# EAGLE design devboard (EAGLE 4.16)
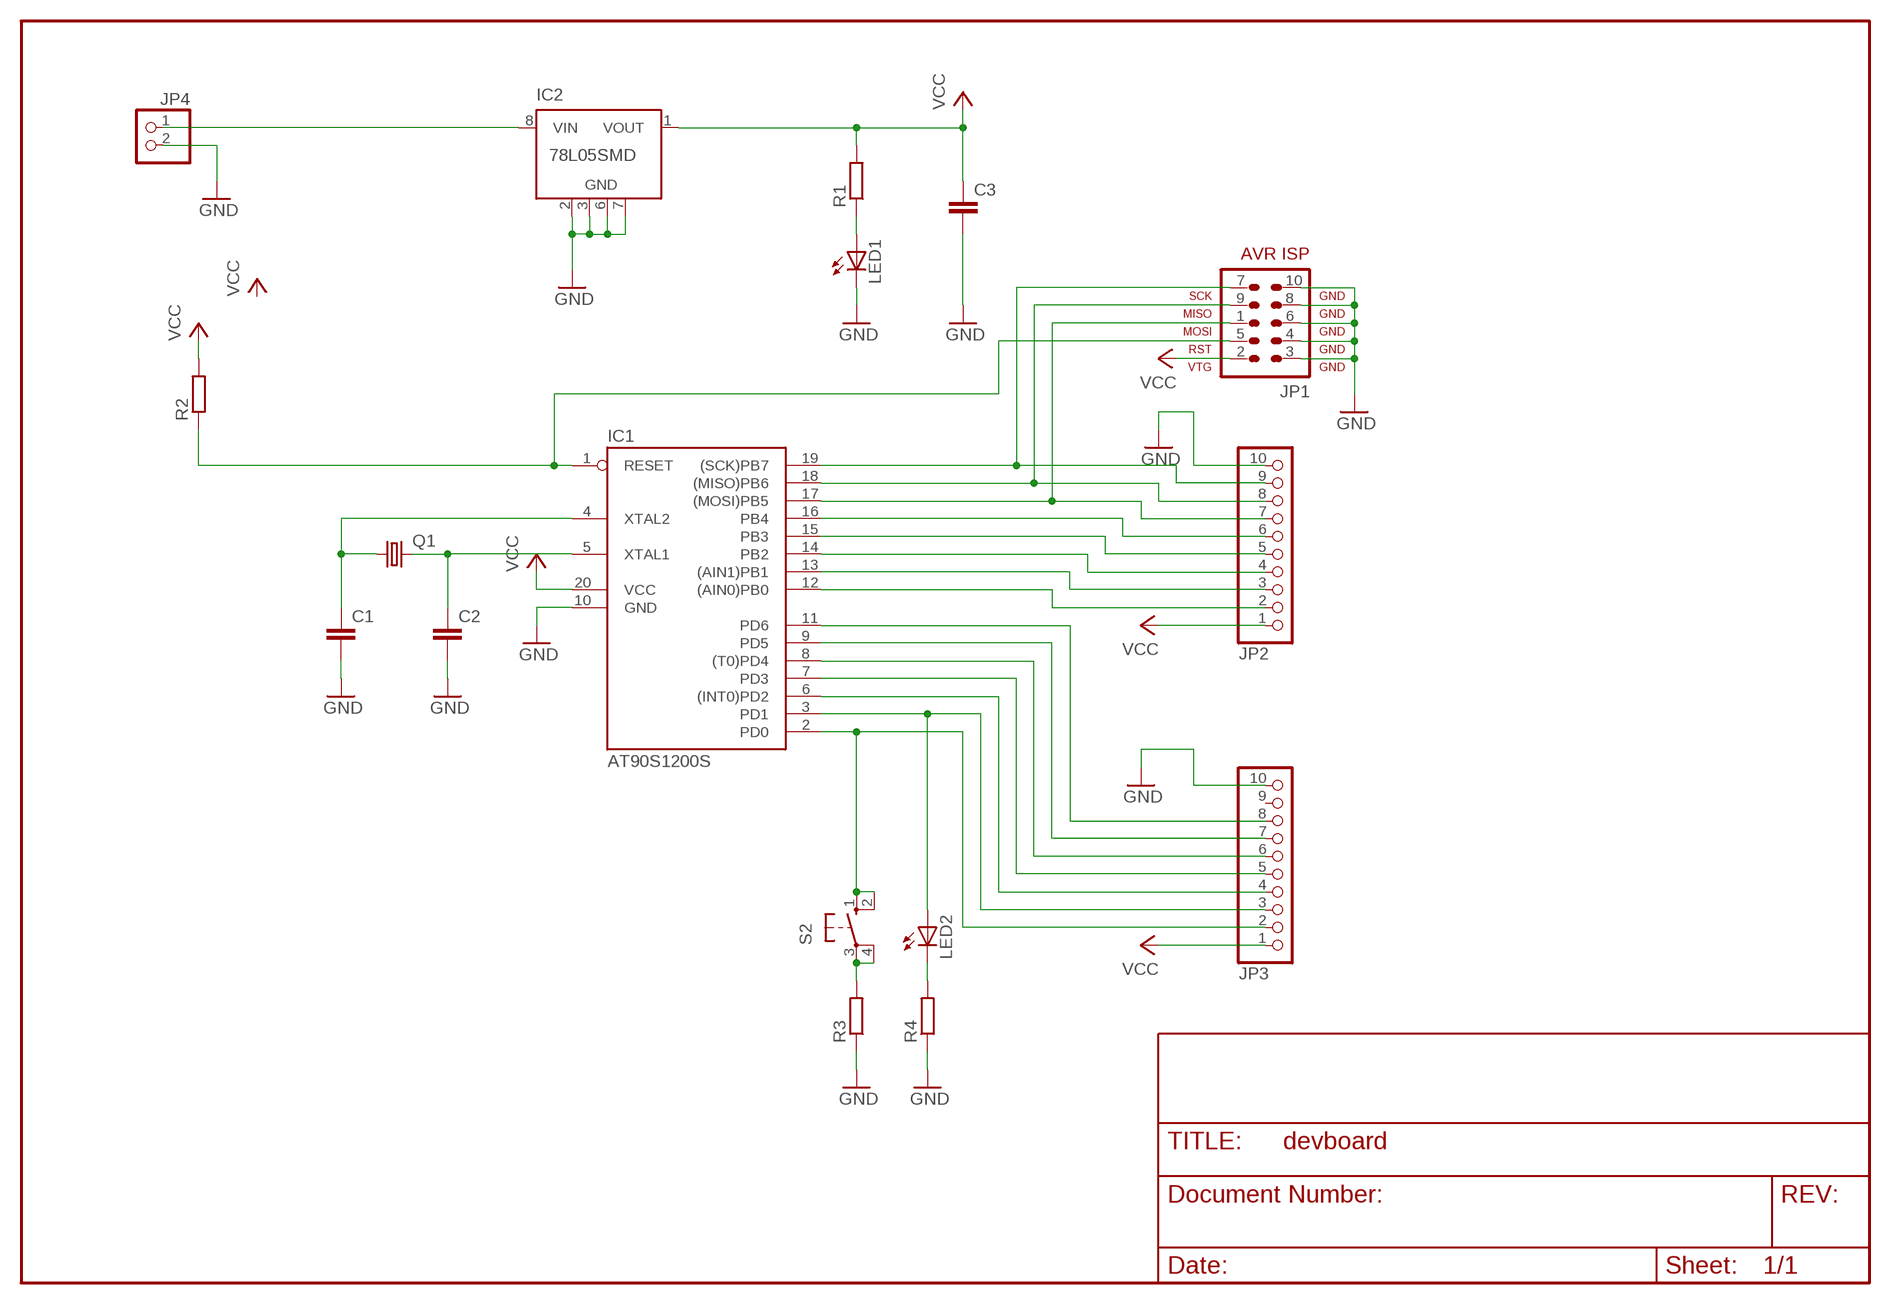
[diagram p0: schematic, sheet 1]

## Parts
C1  C-EUC1206  [C1206]
C2  C-EUC1206  [C1206]
C3  C-EUC1206  [C1206]
IC1  AT90S1200S  [SO20W]
IC2  78L05SMD  [SO08]
JP1  AVR-ISP-10  [AVR-ISP-10]
JP2  PINHD-1X10  [1X10]
JP3  PINHD-1X10  [1X10]
JP4  PINHD-1X2  [1X02]
LED1  LEDCHIPLED_1206  [CHIPLED_1206]
LED2  LEDCHIPLED_1206  [CHIPLED_1206]
Q1  CRYTALHC49UP  [HC49UP]
R1  R-EU_R1206  [R1206]
R2  R-EU_R1206  [R1206]
R3  R-EU_R1206  [R1206]
R4  R-EU_R1206  [R1206]
S2  10-XX  [B3F-10XX]

## Nets
GND: C1.2 C2.2 C3.2 IC1.10(GND) IC2.2(GND) IC2.3(GND) IC2.6(GND) IC2.7(GND) JP1.3 JP1.4 JP1.6 JP1.8 JP1.10 JP2.10 JP3.10 JP4.2 LED1.C R3.1 R4.1
N$1: C2.1 IC1.5(XTAL1) Q1.2
N$2: C1.1 IC1.4(XTAL2) Q1.1
N$3: LED1.A R1.1
N$4: IC2.8(VIN) JP4.1
N$5: IC1.1(RESET) JP1.5 R2.1
N$6: IC1.9(PD5) JP3.7
N$7: R3.2 S2.3(P) S2.4(P1)
N$8: IC1.2(PD0) JP3.2 S2.1(S) S2.2(S1)
N$9: LED2.C R4.2
N$10: IC1.3(PD1) JP3.3 LED2.A
N$11: IC1.19((SCK)PB7) JP1.7 JP2.9
N$12: IC1.18((MISO)PB6) JP1.9 JP2.8
N$13: IC1.17((MOSI)PB5) JP1.1 JP2.7
N$14: IC1.11(PD6) JP3.8
N$15: IC1.12((AIN0)PB0) JP2.2
N$16: IC1.13((AIN1)PB1) JP2.3
N$17: IC1.6((INT0)PD2) JP3.4
N$18: IC1.7(PD3) JP3.5
N$19: IC1.8((T0)PD4) JP3.6
N$20: IC1.14(PB2) JP2.4
N$21: IC1.15(PB3) JP2.5
N$22: IC1.16(PB4) JP2.6
VCC: C3.1 IC1.20(VCC) IC2.1(VOUT) JP1.2 JP2.1 JP3.1 R1.2 R2.2
Unconnected: IC2.4(NC) IC2.5(NC) JP3.9

## Library data of the parts
C1-C3 = rcl:C-EU: CAPACITOR, European symbol
IC1 = atmel:AT90S1200: MICROCONTROLLER 1 Kbytes FLASH 64 bytes EEPROM
IC2 = linear:78L*SMD: Positive VOLTAGE REGULATOR
JP1 = atmel:AVR-ISP-10: AVR ISP-10 Serial Programming Header
JP2 JP3 = pinhead:PINHD-1X10: PIN HEADER
JP4 = pinhead:PINHD-1X2: PIN HEADER
LED1 LED2 = led:LED: LED OSRAM: - CHIPLED LG R971, LG N971, LY N971, LG Q971, LY Q971, LO R971, LY R971 LH N974, LH R974 LS Q976, LO Q976, LY Q976 LO Q996 - Hyper CHIPLED LW Q18S LB Q993, LB Q99A, LB R99A - SideLED LS A670, LO A670, LY A670, LG A670, LP A670 LB A673, LV A673, LT A673, LW A673 LH A674 LY A675 LS A676, LA A676, LO A676, LY A676, LW A676 LS A679, LY A679, LG A679 - Hyper Micro SIDELED® LS Y876, LA Y876, LO Y876, LY Y876 LT Y87S - SmartLED LW L88C, LW L88S LB L89C, LB L89S, LG L890 LS L89K, LO L89K, LY L89K LS L896, LA L896, LO L896, LY L896 - TOPLED LS T670, LO T670, LY T670, LG T670, LP T670 LSG T670, LSP T670, LSY T670, LOP T670, LYG T670 LG T671, LOG T671, LSG T671 LB T673, LV T673, LT T673, LW T673 LH T674 LS T676, LA T676, LO T676, LY T676, LB T676, LH T676, LSB T676, LW T676 LB T67C, LV T67C, LT T67C, LS T67K, LO T67K, LY T67K, LW E67C LS E67B, LA E67B, LO E67B, LY E67B, LB E67C, LV E67C, LT E67C LW T67C LS T679, LY T679, LG T679 LS T770, LO T770, LY T770, LG T770, LP T770 LB T773, LV T773, LT T773, LW T773 LH T774 LS E675, LA E675, LY E675, LS T675 LS T776, LA T776, LO T776, LY T776, LB T776 LHGB T686 LT T68C, LB T68C - Hyper Mini TOPLED® LB M676 - Mini TOPLED Santana® LG M470 LS M47K, LO M47K, LY M47K Source: http://www.osram.convergy.de/
Q1 = crystal:CRYTAL: CRYSTAL
R1-R4 = rcl:R-EU_: RESISTOR, European symbol
S2 = switch-omron:10-XX: OMRON SWITCH

## Net classes
0 default: width 0.406 mm, drill 0.305 mm, clearance 0.7 mm

## Board
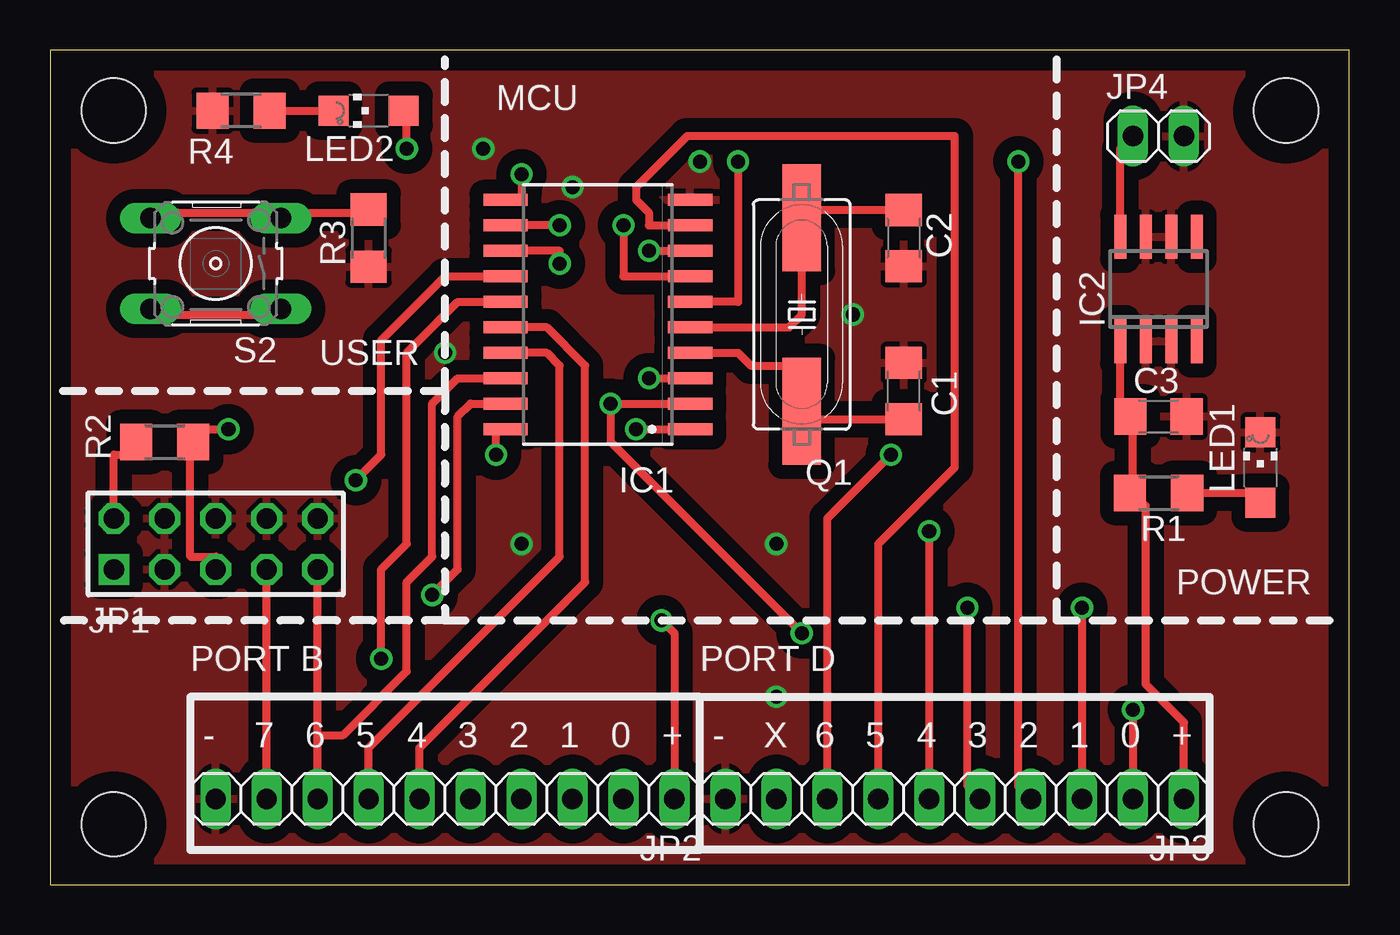
[diagram p1: board, top side]
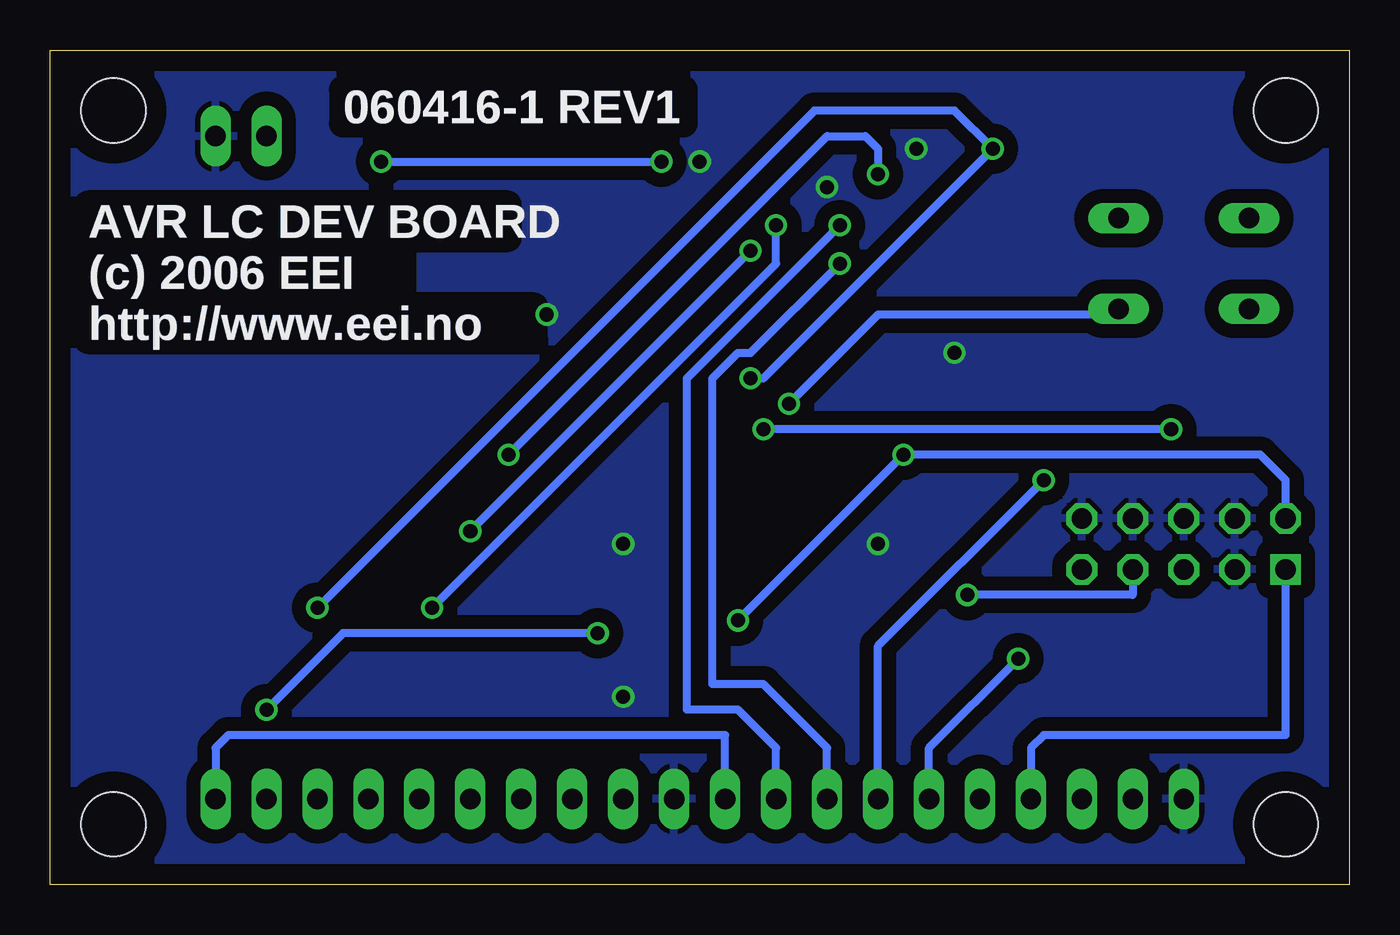
[diagram p2: board, bottom side, seen from below]

Size 64.75 x 41.58 mm. Coordinates in mm from the lower left corner, seen from the top.
Outline: 0,0 64.75,0 64.75,41.58 0,41.58 0,0
Copper layers (1*16): Top 0.035mm / dielectric 1.5mm / Bottom 0.035mm
Design rules "10mils": minimum track width 10mil, minimum drill 24mil, track to track 10mil, track to pad 10mil, pad to pad 10mil, via to via 10mil, smd to smd 10mil, copper to edge 40mil, drill to drill 10mil, minimum pad ring 10mil, minimum via ring 8mil, stop-mask expansion 0mil, vias tented up to drill 0mil, thermal gap 10mil
Holes 3.2 mm at 61.59,3.01 3.17,3.01 3.17,38.57 61.59,38.57

### Footprints (pad centres in the part's own frame; a part is rotated, then mirrored left to right if it is on the bottom)
C1206 = smd 1.6 x 1.8: 1 -1.4,0; 2 1.4,0
SO20W = smd 0.6 x 2.2: 1 -5.715,-4.6; 2 -4.445,-4.6; 3 -3.175,-4.6; 4 -1.905,-4.6; 5 -0.635,-4.6; 6 0.635,-4.6; 7 1.905,-4.6; 8 3.175,-4.6; 9 4.445,-4.6; 10 5.715,-4.6; 11 5.715,4.6; 12 4.445,4.6; 13 3.175,4.6; 14 1.905,4.6; 15 0.635,4.6; 16 -0.635,4.6; 17 -1.905,4.6; 18 -3.175,4.6; 19 -4.445,4.6; 20 -5.715,4.6
SO08 = smd 0.6 x 2.2: 1 -1.905,-2.6; 2 -0.635,-2.6; 3 0.635,-2.6; 4 1.905,-2.6; 5 1.905,2.6; 6 0.635,2.6; 7 -0.635,2.6; 8 -1.905,2.6
AVR-ISP-10 = drill 1.016 square: 1 -5.08,-1.27 | drill 1.016 octagon: 2 -5.08,1.27; 3 -2.54,-1.27; 4 -2.54,1.27; 5 0,-1.27; 6 0,1.27; 7 2.54,-1.27; 8 2.54,1.27; 9 5.08,-1.27; 10 5.08,1.27
1X10 = drill 1.016 long: 1 -11.43,0; 2 -8.89,0; 3 -6.35,0; 4 -3.81,0; 5 -1.27,0; 6 1.27,0; 7 3.81,0; 8 6.35,0; 9 8.89,0; 10 11.43,0
1X02 = drill 1.016 long: 1 -1.27,0; 2 1.27,0
CHIPLED_1206 = smd 1.5 x 1.5: A 0,-1.75; C 0,1.75
HC49UP = smd 5.334 x 1.93: 1 -4.826,0; 2 4.826,0
R1206 = smd 1.6 x 1.803: 1 -1.422,0; 2 1.422,0
B3F-10XX = drill 1.016 long: 1 -3.251,2.261; 2 3.251,2.261; 3 -3.251,-2.261; 4 3.251,-2.261

### Placement (x,y rotation side)
C1  42.54,24.6 90 top
C2  42.54,32.22 270 top
C3  55.24,23.33 0 top
IC1  27.3,28.41 90 top
IC2  55.24,29.68 0 top
JP1  8.25,16.98 0 top
JP2  19.68,4.28 180 top
JP3  45.08,4.28 180 top
JP4  55.24,37.3 0 top
LED1  60.32,20.79 0 top
LED2  15.87,38.57 90 top
Q1  37.46,28.41 90 top
R1  55.24,19.52 180 top
R2  5.71,22.06 180 top
R3  15.87,32.22 90 top
R4  9.52,38.57 0 top
S2  8.25,30.95 180 top

### Tracks (layer width: path | path; a pad name or v marks a point on that pad's centre or on a via)
GND  (via drill 0.7)
  other vias: 36.19,9.36 40,28.41 32.38,36.03 36.19,16.98 23.49,16.98 21.58,36.66 19.68,26.5 26.03,34.76
  pour Top: -0.64,42.38 -0.64,-0.8 65.4,-0.8 65.4,42.38
  pour Bottom: -0.64,42.38 -0.64,-0.8 65.4,-0.8 65.4,42.38
N$1
  Top 0.406: IC1.5 36.83,27.77 37.46,28.41 Q1.2 37.46,33.49 37.59,33.62 C2.1
N$2
  Top 0.406: IC1.4 34.29,26.5 34.92,25.87 37.46,25.87 Q1.1 37.46,23.33 37.59,23.2 C1.1
N$3
  Top 0.406: LED1.A 59.69,19.52 R1.1
N$4
  Top 0.406: IC2.8 53.34,36.66 JP4.1
N$5  (via drill 0.7)
  Top 0.406: JP1.5 8.25,16.34 6.98,16.34 6.98,21.42 R2.1 7.62,22.7 v8.89,22.7 | v29.2,22.7 IC1.1
  Bottom 0.406: v8.89,22.7 v29.2,22.7
N$6
  Top 0.406: IC1.9 29.84,32.85 29.84,33.49 29.2,34.12 29.2,34.76 31.74,37.3 45.08,37.3 45.08,20.79 41.27,16.98 JP3.7
N$7
  Top 0.406: R3.2 15.24,33.49 12.7,33.49 S2.3 10.16,33.49 6.34,33.49 S2.4
N$8  (via drill 0.7)
  Top 0.406: IC1.2 v27.93,23.96 27.93,22.06 v37.46,12.54 | S2.2 6.34,28.41 10.16,28.41 S2.1 | v53.97,8.73 JP3.2
  Bottom 0.406: v27.93,23.96 23.49,28.41 12.7,28.41 S2.1 | v53.97,8.73 50.16,12.54 v37.46,12.54
N$9
  Top 0.406: R4.2 LED2.C
N$10  (via drill 0.7)
  Top 0.406: v17.77,36.66 17.77,37.94 LED2.A | v29.84,25.23 IC1.3 | v51.43,13.81 JP3.3
  Bottom 0.406: v29.84,25.23 29.2,25.23 v17.77,36.66 19.68,38.57 26.66,38.57 v51.43,13.81
N$11  (via drill 0.7)
  Top 0.406: v19.04,14.44 20.31,15.71 20.31,23.33 20.95,23.96 IC1.19 | JP2.9 JP1.7
  Bottom 0.406: v19.04,14.44 10.79,14.44 JP1.7
N$12
  Top 0.406: IC1.18 20.31,25.23 19.04,23.96 19.04,16.34 17.77,15.08 17.77,10.63 14.6,7.46 13.33,7.46 | JP2.8 13.33,7.46 | 13.33,7.46 JP1.9
N$13
  Top 0.406: IC1.17 24.76,26.5 25.39,25.87 25.39,16.34 15.87,6.82 JP2.7
  Bottom 0.406: JP1.1 3.17,7.46 15.24,7.46 15.87,6.82 JP2.7
N$14  (via drill 0.7)
  Top 0.406: v23.49,35.39 23.49,34.12 IC1.11 | v41.91,21.42 38.73,18.25 JP3.8
  Bottom 0.406: v41.91,21.42 26.03,37.3 24.12,37.3 23.49,36.66 v23.49,35.39
N$15  (via drill 0.7)
  Top 0.406: v25.39,32.85 IC1.12
  Bottom 0.406: v25.39,32.85 33.02,25.23 33.02,8.73 30.47,8.73 28.57,6.82 JP2.2
N$16  (via drill 0.7)
  Top 0.406: v25.39,30.95 25.39,31.58 IC1.13
  Bottom 0.406: v25.39,30.95 29.84,26.5 30.47,26.5 31.74,25.23 31.74,10 29.2,10 26.03,6.82 JP2.3
N$17  (via drill 0.7)
  Top 0.406: v34.29,36.03 34.29,29.04 IC1.6 | JP3.4 48.26,4.92 v48.26,36.03
  Bottom 0.406: v48.26,36.03 v34.29,36.03
N$18  (via drill 0.7)
  Top 0.406: v28.57,32.85 28.57,30.31 IC1.7 | v45.72,13.81 45.72,4.92 JP3.5
  Bottom 0.406: v28.57,32.85 28.57,30.95 v45.72,13.81
N$19  (via drill 0.7)
  Top 0.406: v29.84,31.58 IC1.8 | JP3.6 v43.81,17.61
  Bottom 0.406: v43.81,17.61 v29.84,31.58
N$20  (via drill 0.7)
  Top 0.406: IC1.14 19.68,30.31 16.5,27.14 16.5,21.42 v15.24,20.15
  Bottom 0.406: v15.24,20.15 23.49,11.9 JP2.4
N$21  (via drill 0.7)
  Top 0.406: IC1.15 20.31,29.04 17.77,26.5 17.77,16.98 16.5,15.71 v16.5,11.27
  Bottom 0.406: v16.5,11.27 20.95,6.82 JP2.5
N$22
  Top 0.406: JP2.6 18.41,6.82 26.66,15.08 26.66,25.87 24.76,27.77 IC1.16
VCC  (via drill 0.7)
  Top 0.406: R2.2 3.8,21.42 3.17,21.42 JP1.2 | v22.22,21.42 22.22,22.7 IC1.20 | IC2.1 53.34,23.96 C3.1 53.97,22.7 53.97,20.15 R1.2 54.61,18.88 54.61,10 56.51,8.09 JP3.1 | v30.47,13.17 31.11,12.54 JP2.1
  Bottom 0.406: JP1.2 3.17,20.15 4.44,21.42 v22.22,21.42 v30.47,13.17 | JP2.1 31.11,7.46 55.88,7.46 56.51,6.82 JP3.1

### Text on the board
Bottom: 060416-1 REV1 | AVR LC DEV BOARD | (c) 2006 EEI | http://www.eei.no
tPlace: MCU | USER | POWER | PORT B | PORT D | - | 7 | 6 | 5 | 4 | 3 | 2 | 1 | 0 | + | - | X | 6 | 5 | 4 | 3 | 2 | 1 | 0 | +
bNames: 060416-1 REV1 | AVR LC DEV BOARD | (c) 2006 EEI | http://www.eei.no